# EAGLE design Trans.eagle (EAGLE 9.3.0)
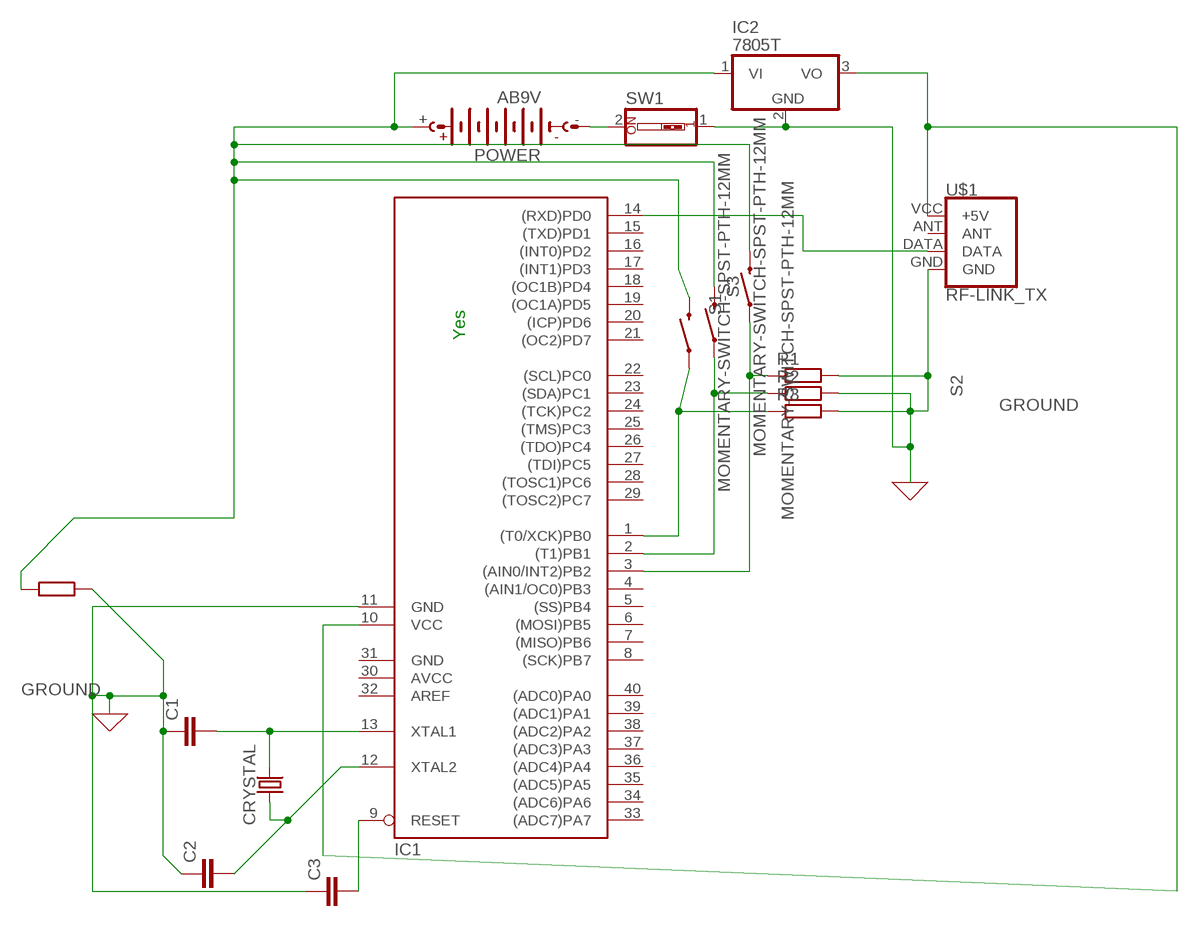
[diagram p0: schematic, sheet 1]

## Parts
C1  10nF  10NF-PTH-10MM-10000V-1-%  [CAP-PTH-10MM]
C2  10nF  10NF-PTH-10MM-10000V-1-%  [CAP-PTH-10MM]
C3  10nF  10NF-PTH-10MM-10000V-1-%  [CAP-PTH-10MM]
CRYSTAL  CRYSTALPTH-HC49UV  [HC49U]
IC1  MEGA32-P  [DIL40]
IC2  7805T  [TO220H]
POWER  AB9V  [AB9V]
R1  R-EU_0309/12  [0309/12]
R2  R-EU_0309/12  [0309/12]
R3  R-EU_0309/12  [0309/12]
R4  R-EU_0309/12  [0309/12]
S1  MOMENTARY-SWITCH-SPST-PTH-12MM  [TACTILE_SWITCH_PTH_12MM]
S2  MOMENTARY-SWITCH-SPST-PTH-12MM  [TACTILE_SWITCH_PTH_12MM]
S3  MOMENTARY-SWITCH-SPST-PTH-12MM  [TACTILE_SWITCH_PTH_12MM]
SW1  SW_DIP-1  [EDG-01]
U$1  RF-LINK_TX  [RF-LINK_TX]

## Nets
GROUND: C1.1 C2.1 C3.1 IC1.11(GND) IC2.2(GND) R1.2 R2.2 R3.2 R4.1 SW1.1 U$1.GND ; supply symbol labelled GND
N$1: IC1.1((T0/XCK)PB0) R3.1 S2.1
N$2: IC1.2((T1)PB1) R2.1 S1.1
N$3: IC1.10(VCC) IC2.3(VO) U$1.VCC(+5V)
N$4: IC1.3((AIN0/INT2)PB2) R1.1 S3.1
N$5: C2.2 CRYSTAL.1 IC1.12(XTAL2)
N$6: POWER.- SW1.2
N$10: IC1.14((RXD)PD0) U$1.DATA
N$11: C1.2 CRYSTAL.2 IC1.13(XTAL1)
N$12: C3.2 IC1.9(RESET)
POWER: IC2.1(VI) POWER.+ R4.2 S1.3 S2.3 S3.3
Unconnected: IC1.4((AIN1/OC0)PB3) IC1.5((SS)PB4) IC1.6((MOSI)PB5) IC1.7((MISO)PB6) IC1.8((SCK)PB7) IC1.15((TXD)PD1) IC1.16((INT0)PD2) IC1.17((INT1)PD3) IC1.18((OC1B)PD4) IC1.19((OC1A)PD5) IC1.20((ICP)PD6) IC1.21((OC2)PD7) IC1.22((SCL)PC0) IC1.23((SDA)PC1) IC1.24((TCK)PC2) IC1.25((TMS)PC3) IC1.26((TDO)PC4) IC1.27((TDI)PC5) IC1.28((TOSC1)PC6) IC1.29((TOSC2)PC7) IC1.32(AREF) IC1.33((ADC7)PA7) IC1.34((ADC6)PA6) IC1.35((ADC5)PA5) IC1.36((ADC4)PA4) IC1.37((ADC3)PA3) IC1.38((ADC2)PA2) IC1.39((ADC1)PA1) IC1.40((ADC0)PA0) U$1.ANT

## Notes on the sheet
- Yes

## Power pins joined to a net without a drawn wire
AVCC: IC1.30(AVCC)
GND: IC1.31(GND)

## Library data of the parts
C1-C3 = SparkFun-Capacitors:10NF: 0.01uF/10nF/10,000pF ceramic capacitors A capacitor is a passive two-terminal electrical component used to store electrical energy temporarily in an electric field. CAP-09321; PROD_ID: CAP-09321
CRYSTAL = SparkFun-Clocks:CRYSTAL: Crystals (Generic) These are passive quartz crystals, which can be used as a clock source for a microcontroller. Crystal's are two-terminal devices. They require external "load" capacitors to generate an oscillating signal.
IC1 = atmel:MEGA32-P: MICROCONTROLLER 32 Kbytes FLASH 2 Kbytes SRAM 1 Kbytes EEPROM USART 8-channel 10 bit ADC Source: www.atmel.com .. doc2503.pdf; MPN: ATMEGA32-16PU; OC_FARNELL: 1661729; OC_NEWARK: 51P1794
IC2 = linear:78*: Positive VOLTAGE REGULATOR Source: http://cache.national.com/ds/LM/LM78L05.pdf http://www.fairchildsemi.com/ds/LM/LM7805.pdf
POWER = battery:AB9V: 9-V BATTERY CLIP
R1-R4 = rcl:R-EU_: RESISTOR, European symbol; SPICEPREFIX: R
S1-S3 = SparkFun-Switches:MOMENTARY-SWITCH-SPST: Momentary Switch (Pushbutton) - SPST Normally-open (NO) SPST momentary switches (buttons, pushbuttons). Variants PTH-12MM - 12mm square, through-hole Momentary Pushbutton Switch - 12mm Square <https://www.sparkfun.com/products/9190> (COM-09190) PTH-6.0MM, PTH-6.0MM-KIT - 6.0mm square, through-hole Mini Pushbutton Switch <https://www.sparkfun.com/products/97> (COM-00097) KIT package intended for soldering kit's - only one side of pads' copper is exposed. PTH-RIGHT-ANGLE-KIT - Right-angle, through-hole Right Angle Tactile Button <https://www.sparkfun.com/products/10791> - Used on SparkFun BigTime Watch Kit <https://www.sparkfun.com/products/11734> SMD-12MM - 12mm square, surface-mount Tactile Button - SMD (12mm) <https://www.sparkfun.com/products/12993> (COM-12993) Used on SparkFun PicoBoard <https://www.sparkfun.com/products/11888> SMD-4.5MM - 4.5mm Square Trackball Switch Used on SparkFun Blackberry Trackballer Breakout <https://www.sparkfun.com/products/13169> SMD-4.6MMX2.8MM - 4.60mm x 2.80mm, surface mount Used on SparkFun SAMD21 Mini Breakout <https://www.sparkfun.com/products/13664> SMD-5.2MM, SMD-5.2-REDUNDANT - 5.2mm square, surface-mount Mini Pushbutton Switch - SMD <https://www.sparkfun.com/products/8720> (COM-08720) Used on Arduino Pro Mini <https://www.sparkfun.com/products/11114> REDUNDANT package connects both switch circuits together SMD-6.0X3.5MM - 6.0 x 3.5mm, surface mount Momentary Reset Switch SMD <https://www.sparkfun.com/products/8229> (COM-08229) SMD-6.2MM-TALL - 6.2mm square, surface mount Tactile Button - SMD (6mm) <https://www.sparkfun.com/products/12992> Used on SparkFun Digital Sandbox <https://www.sparkfun.com/products/12651> SMD-RIGHT-ANGLE - Right-angle, surface mount Used on SparkFun Block for Intel® Edison - Arduino <https://www.sparkfun.com/products/13036>; PROD_ID: SWCH-09185; SF_SKU: COM-09190
SW1 = special:SW_DIP-1: DIP SWITCH
U$1 = SparkFun-RF:RF-LINK_TX: RF Link Transmitter (434 MHz, 315 MHz) These wireless transmitters work with equivalent receivers. They can easily fit into a breadboard and work well with microcontrollers to create a very simple wireless data link. Since these are only transmitters, they will only work communicating data one-way, you would need two pairs (of different frequencies) to act as a transmitter/receiver pair. SparkFun Products RF Link Transmitter - 434MHz <https://www.sparkfun.com/products/10534> (WRL-10534); SF_ID: WRL-10534

## Net classes
0 default: width 0.3 mm, drill 0.6 mm, clearance 0.3 mm

## Board
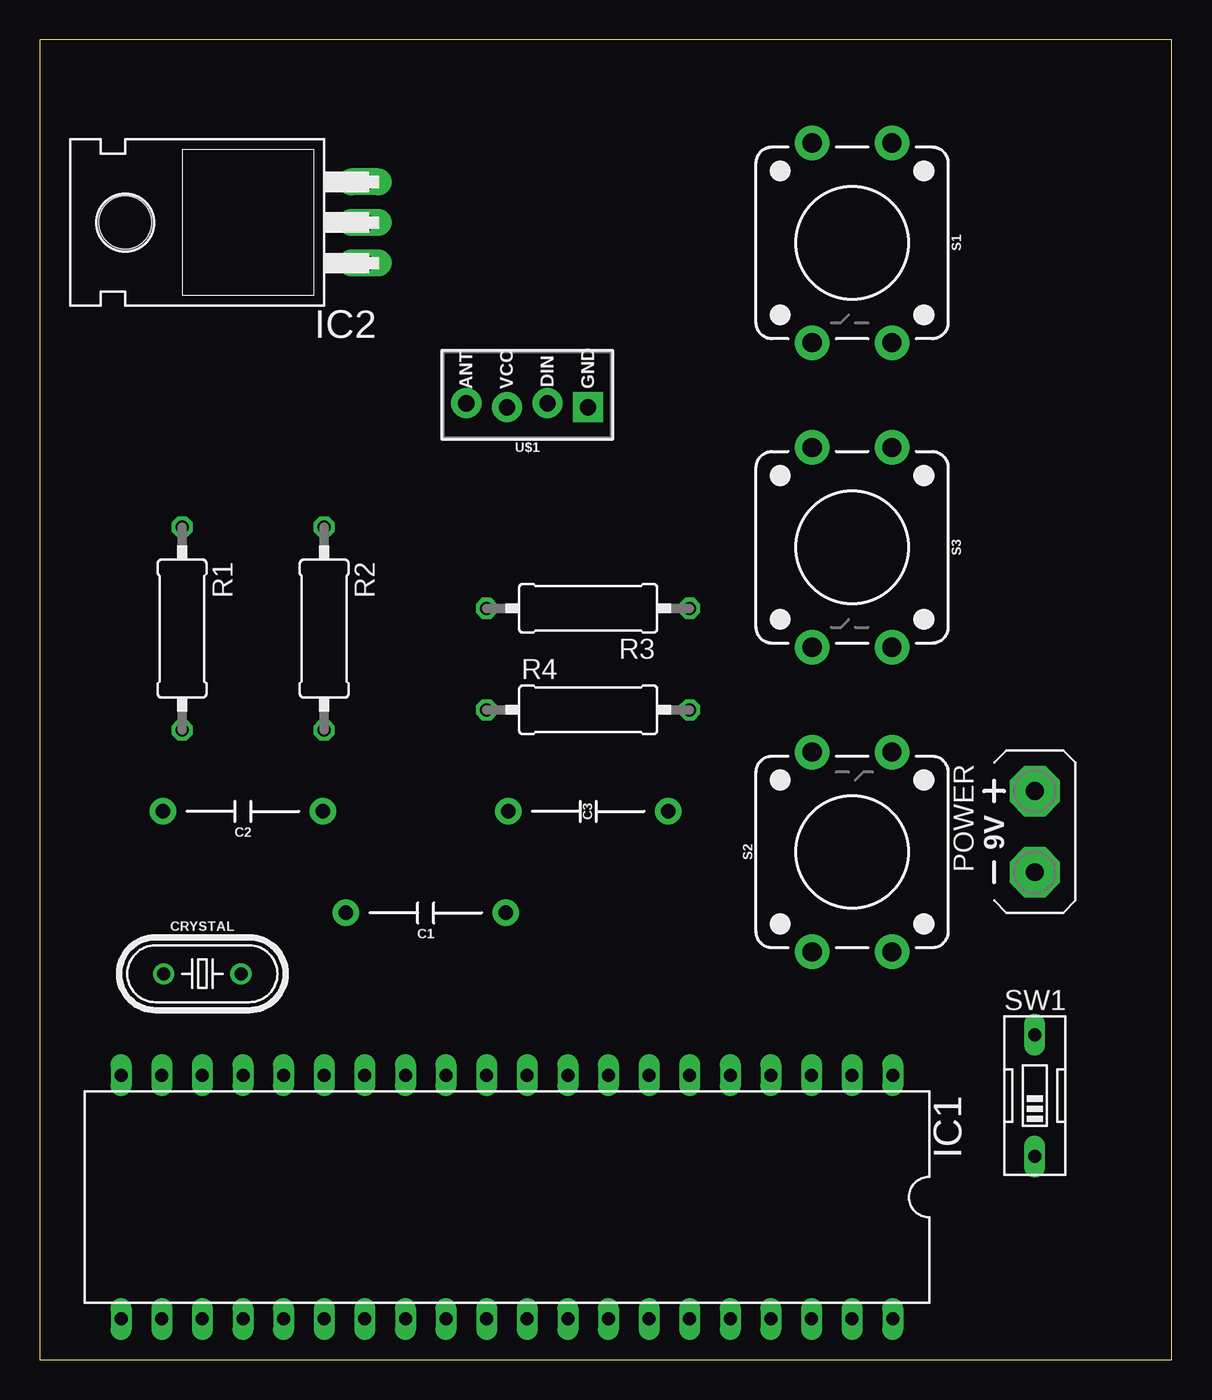
[diagram p1: board, top side]
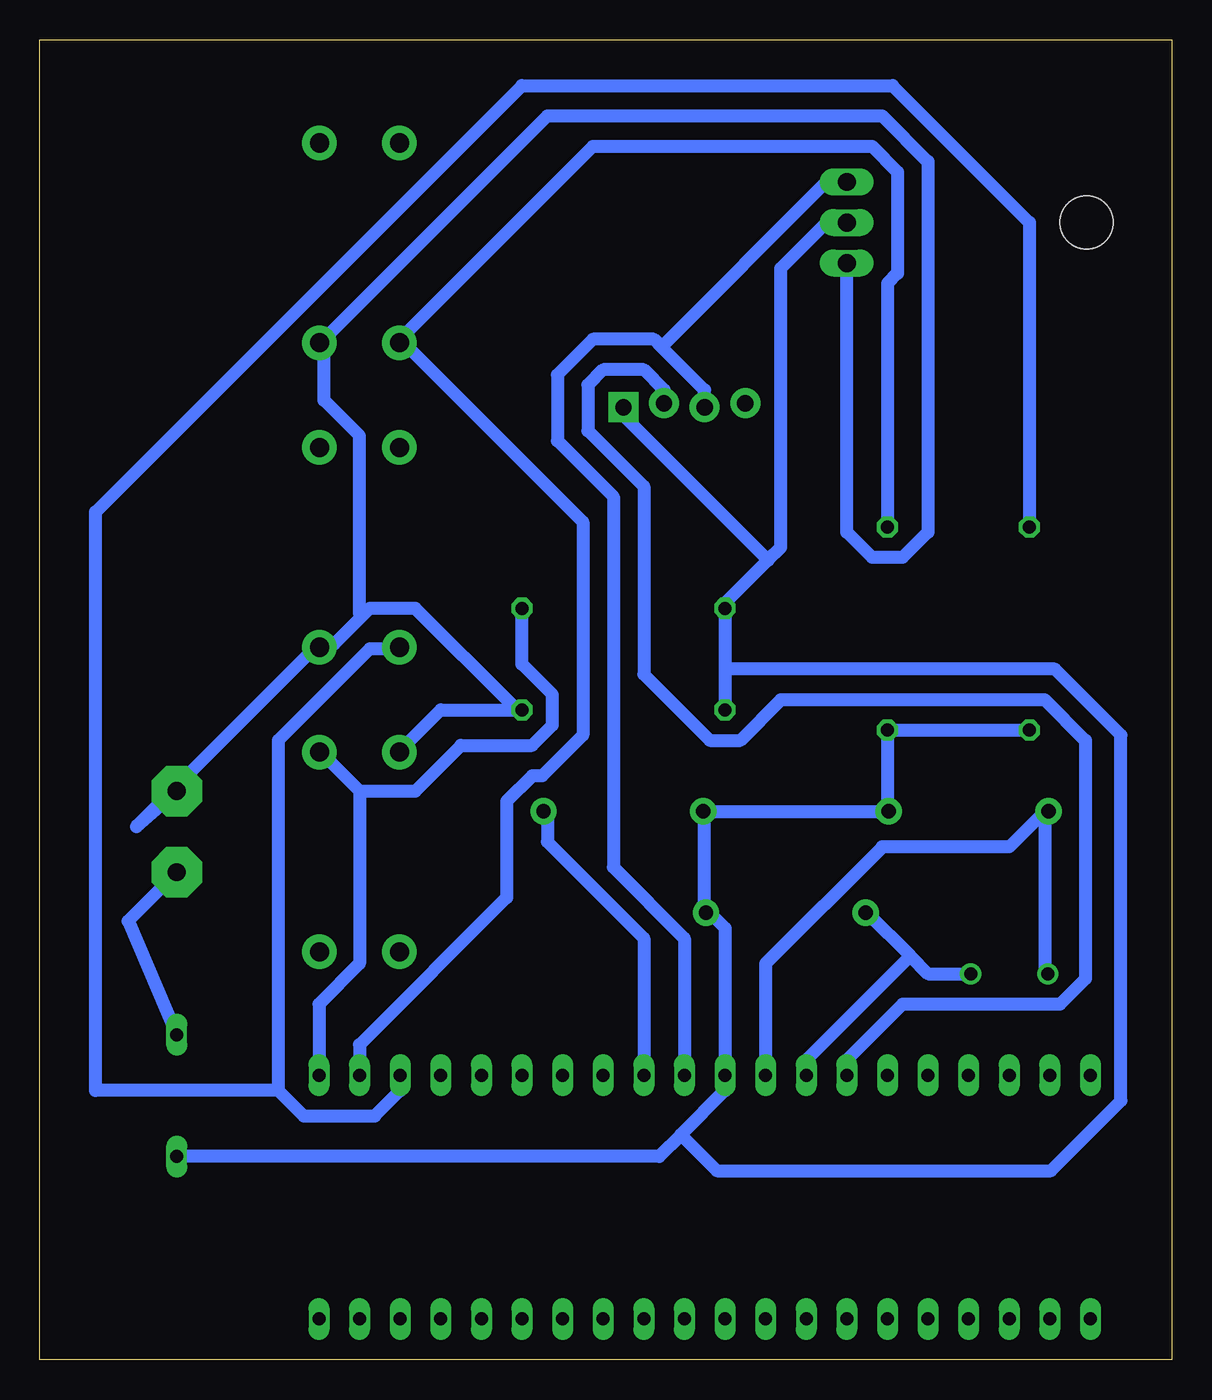
[diagram p2: board, bottom side, seen from below]

Size 70.79 x 82.54 mm. Coordinates in mm from the lower left corner, seen from the top.
Outline: 0,0 70.79,0 70.79,82.54 0,82.54 0,0
Copper layers (1*16): Top 0.035mm / dielectric 1.5mm / Bottom 0.035mm
Design rules "default *": minimum track width 0.8mm, minimum drill 0.8mm, track to track 0.8mm, track to pad 0.8mm, pad to pad 6mil, via to via 6mil, smd to smd 6mil, copper to edge 40mil, drill to drill 6mil, minimum pad ring 10mil, minimum via ring 8mil, stop-mask expansion 4mil, vias tented up to drill 0mil, thermal gap 10mil

### Footprints (pad centres in the part's own frame; a part is rotated, then mirrored left to right if it is on the bottom)
CAP-PTH-10MM = drill 0.9 pad 1.651: 1 -5,0; 2 5,0
HC49U = drill 0.813: 1 -2.413,0; 2 2.413,0
DIL40 = drill 0.813 long: 1 -24.13,-7.62; 2 -21.59,-7.62; 3 -19.05,-7.62; 4 -16.51,-7.62; 5 -13.97,-7.62; 6 -11.43,-7.62; 7 -8.89,-7.62; 8 -6.35,-7.62; 9 -3.81,-7.62; 10 -1.27,-7.62; 11 1.27,-7.62; 12 3.81,-7.62; 13 6.35,-7.62; 14 8.89,-7.62; 15 11.43,-7.62; 16 13.97,-7.62; 17 16.51,-7.62; 18 19.05,-7.62; 19 21.59,-7.62; 20 24.13,-7.62; 21 24.13,7.62; 22 21.59,7.62; 23 19.05,7.62; 24 16.51,7.62; 25 13.97,7.62; 26 11.43,7.62; 27 8.89,7.62; 28 6.35,7.62; 29 3.81,7.62; 30 1.27,7.62; 31 -1.27,7.62; 32 -3.81,7.62; 33 -6.35,7.62; 34 -8.89,7.62; 35 -11.43,7.62; 36 -13.97,7.62; 37 -16.51,7.62; 38 -19.05,7.62; 39 -21.59,7.62; 40 -24.13,7.62
TO220H = drill 1.118 long: 1 -2.54,-10.16; 2 0,-10.16; 3 2.54,-10.16 | hole 3.302: 0,4.826
AB9V = drill 1.118 pad 3.15 octagon: + 0,2.54; - 0,-2.54
0309/12 = drill 0.813 octagon: 1 -6.35,0; 2 6.35,0
TACTILE_SWITCH_PTH_12MM = drill 1.2 pad 2.159: 1 6.25,-2.5; 2 -6.25,-2.5; 3 6.25,2.5; 4 -6.25,2.5
EDG-01 = drill 0.813 long: 1 0,-3.81; 2 0,3.81
RF-LINK_TX = drill 1.016 pad 1.88: ANT 3.81,-0.127; DATA -1.27,-0.127; VCC 1.27,0.127 | drill 1.016 pad 1.88 square: GND -3.81,0.127

### Placement (x,y rotation side)
C1  24.13,27.94 180 top
C2  12.7,34.29 180 top
C3  34.29,34.29 0 top
CRYSTAL  10.16,24.13 0 top
IC1  29.21,10.16 180 top
IC2  10.16,71.12 90 top
POWER  62.23,33.02 0 top
R1  8.89,45.72 270 top
R2  17.78,45.72 270 top
R3  34.29,46.99 180 top
R4  34.29,40.64 0 top
S1  50.8,69.85 270 top
S2  50.8,31.75 90 top
S3  50.8,50.8 270 top
SW1  62.23,16.51 0 top
U$1  30.48,59.69 180 top

### Tracks (layer width: path | path; a pad name or v marks a point on that pad's centre or on a via)
GROUND
  Bottom 0.8: 27.94,43.18 R3.2 27.94,47.31 25.24,50.01 | 27.94,43.18 R4.1 | IC2.2 21.59,71.12 24.45,68.26 24.45,50.8 25.24,50.01 | U$1.GND 34.29,59.05 25.24,50.01 | R1.2 R2.2 17.78,34.29 C2.1 C3.1 29.21,34.29 29.21,28.26 C1.1 28.89,27.94 27.94,26.99 IC1.11 27.94,16.83 30.7,14.06 | SW1.1 32.07,12.7 30.7,14.06 | 27.94,43.18 7.3,43.18 3.17,39.05 3.17,16.19 7.56,11.81 28.45,11.81 30.7,14.06
N$1
  Bottom 0.8: R3.1 40.64,43.5 38.73,41.59 38.73,39.69 40.01,38.42 44.45,38.42 47.31,35.56 50.8,35.56 | 50.8,35.56 53.02,37.78 S2.1 | IC1.1 53.34,22.23 50.8,24.77 50.8,35.56
N$2
  Bottom 0.8: R2.1 17.78,67.31 17.14,67.94 17.14,74.3 18.73,75.88 36.2,75.88 48.26,63.82 S1.1 47.94,63.5 36.83,52.39 36.83,39.05 39.37,36.51 40.01,36.51 41.59,34.92 41.59,28.89 50.8,19.68 IC1.2
N$3
  Bottom 0.8: IC1.10 30.48,26.35 34.93,30.8 34.93,53.98 38.42,57.47 38.42,61.59 36.2,63.82 32.38,63.82 31.91,63.34 | 31.91,63.34 29.21,60.64 U$1.VCC | IC2.3 21.59,73.66 31.91,63.34
N$4
  Bottom 0.8: IC1.3 48.26,16.83 49.85,15.24 54.29,15.24 55.88,16.83 | 55.88,16.83 55.88,38.73 50.17,44.45 48.58,44.45 S3.1 | R1.1 8.89,71.12 17.46,79.69 40.64,79.69 67.31,53.02 67.31,16.83 55.88,16.83
N$5
  Bottom 0.8: IC1.12 25.4,24.77 18.1,32.07 10.16,32.07 7.94,34.29 C2.2 7.94,33.97 7.94,24.13 CRYSTAL.1
N$6
  Bottom 0.8: SW1.2 65.28,27.43 POWER.-
N$10
  Bottom 0.8: IC1.14 20.32,18.73 16.83,22.23 6.98,22.23 5.4,23.81 5.4,38.73 7.94,41.27 24.45,41.27 26.99,38.73 28.89,38.73 33.02,42.86 33.02,54.61 36.51,58.1 36.51,60.96 35.56,61.91 33.02,61.91 31.75,60.64 U$1.DATA
N$11
  Bottom 0.8: CRYSTAL.2 15.24,24.13 16.35,25.24 | 16.35,25.24 19.05,27.94 C1.2 | IC1.13 22.86,18.73 16.35,25.24
N$12
  Bottom 0.8: IC1.9 33.02,26.35 39.05,32.38 39.05,34.29 C3.2
POWER
  Bottom 0.8: IC2.1 20.32,51.75 18.73,50.16 16.83,50.16 15.24,51.75 15.24,74.93 18.1,77.79 39.05,77.79 53.02,63.82 S1.3 53.02,63.5 53.02,60.01 50.8,57.78 50.8,46.67 50.64,46.51 | 41.27,40.64 45.72,40.64 48.26,38.1 S2.3 | 41.27,40.64 R4.2 | 50.64,46.51 50.17,46.99 47.31,46.99 41.27,40.96 41.27,40.64 | 50.64,46.51 52.39,44.77 53.02,44.77 S3.3 53.66,44.45 64.77,33.34 POWER.+